# EasyEDA Pro project design.epro, schematic board_top_schematic

## Sheets
1 controller: Board Name: board_top; Create Date: 2025-03-20; Page Name: controller; Project Name: macropad-final; Schematic Name: board_top_schematic; Update Date: 2025-03-27; Company: EasyEDA.com; Page Size: A4; Version: V1.0
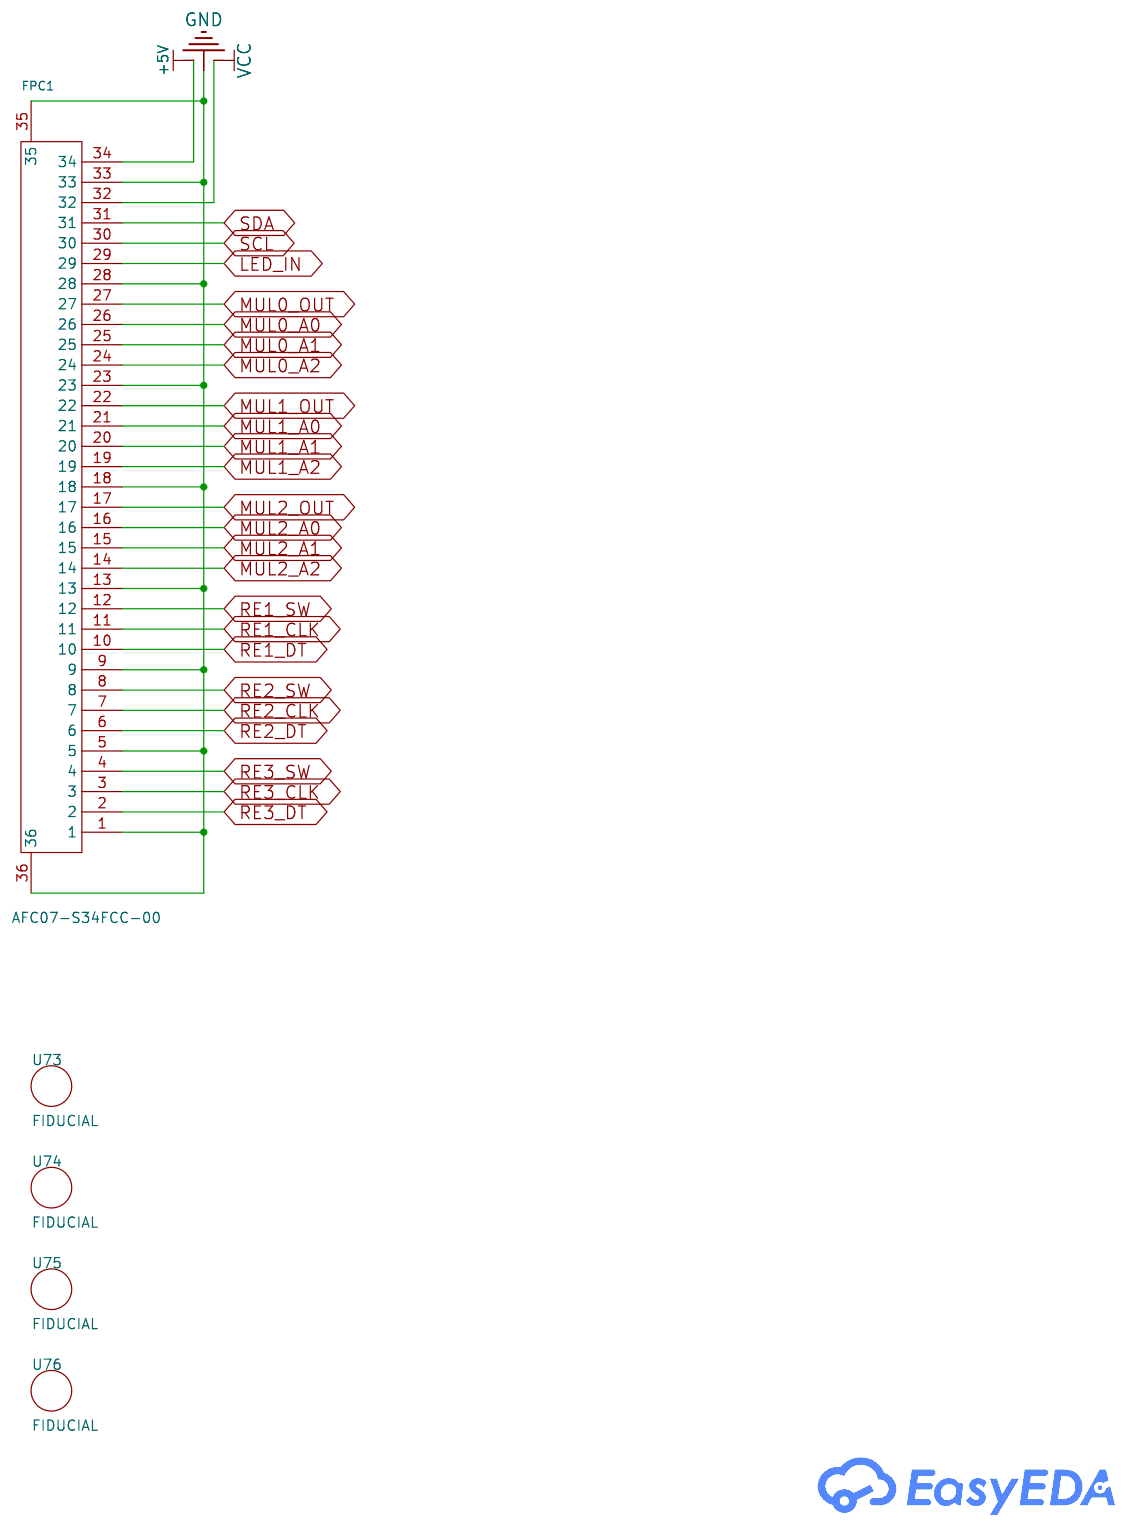
[diagram p4: controller]
2 button_matrix: Create Date: 2025-03-21; Page Name: button_matrix; Update Date: 2025-03-24
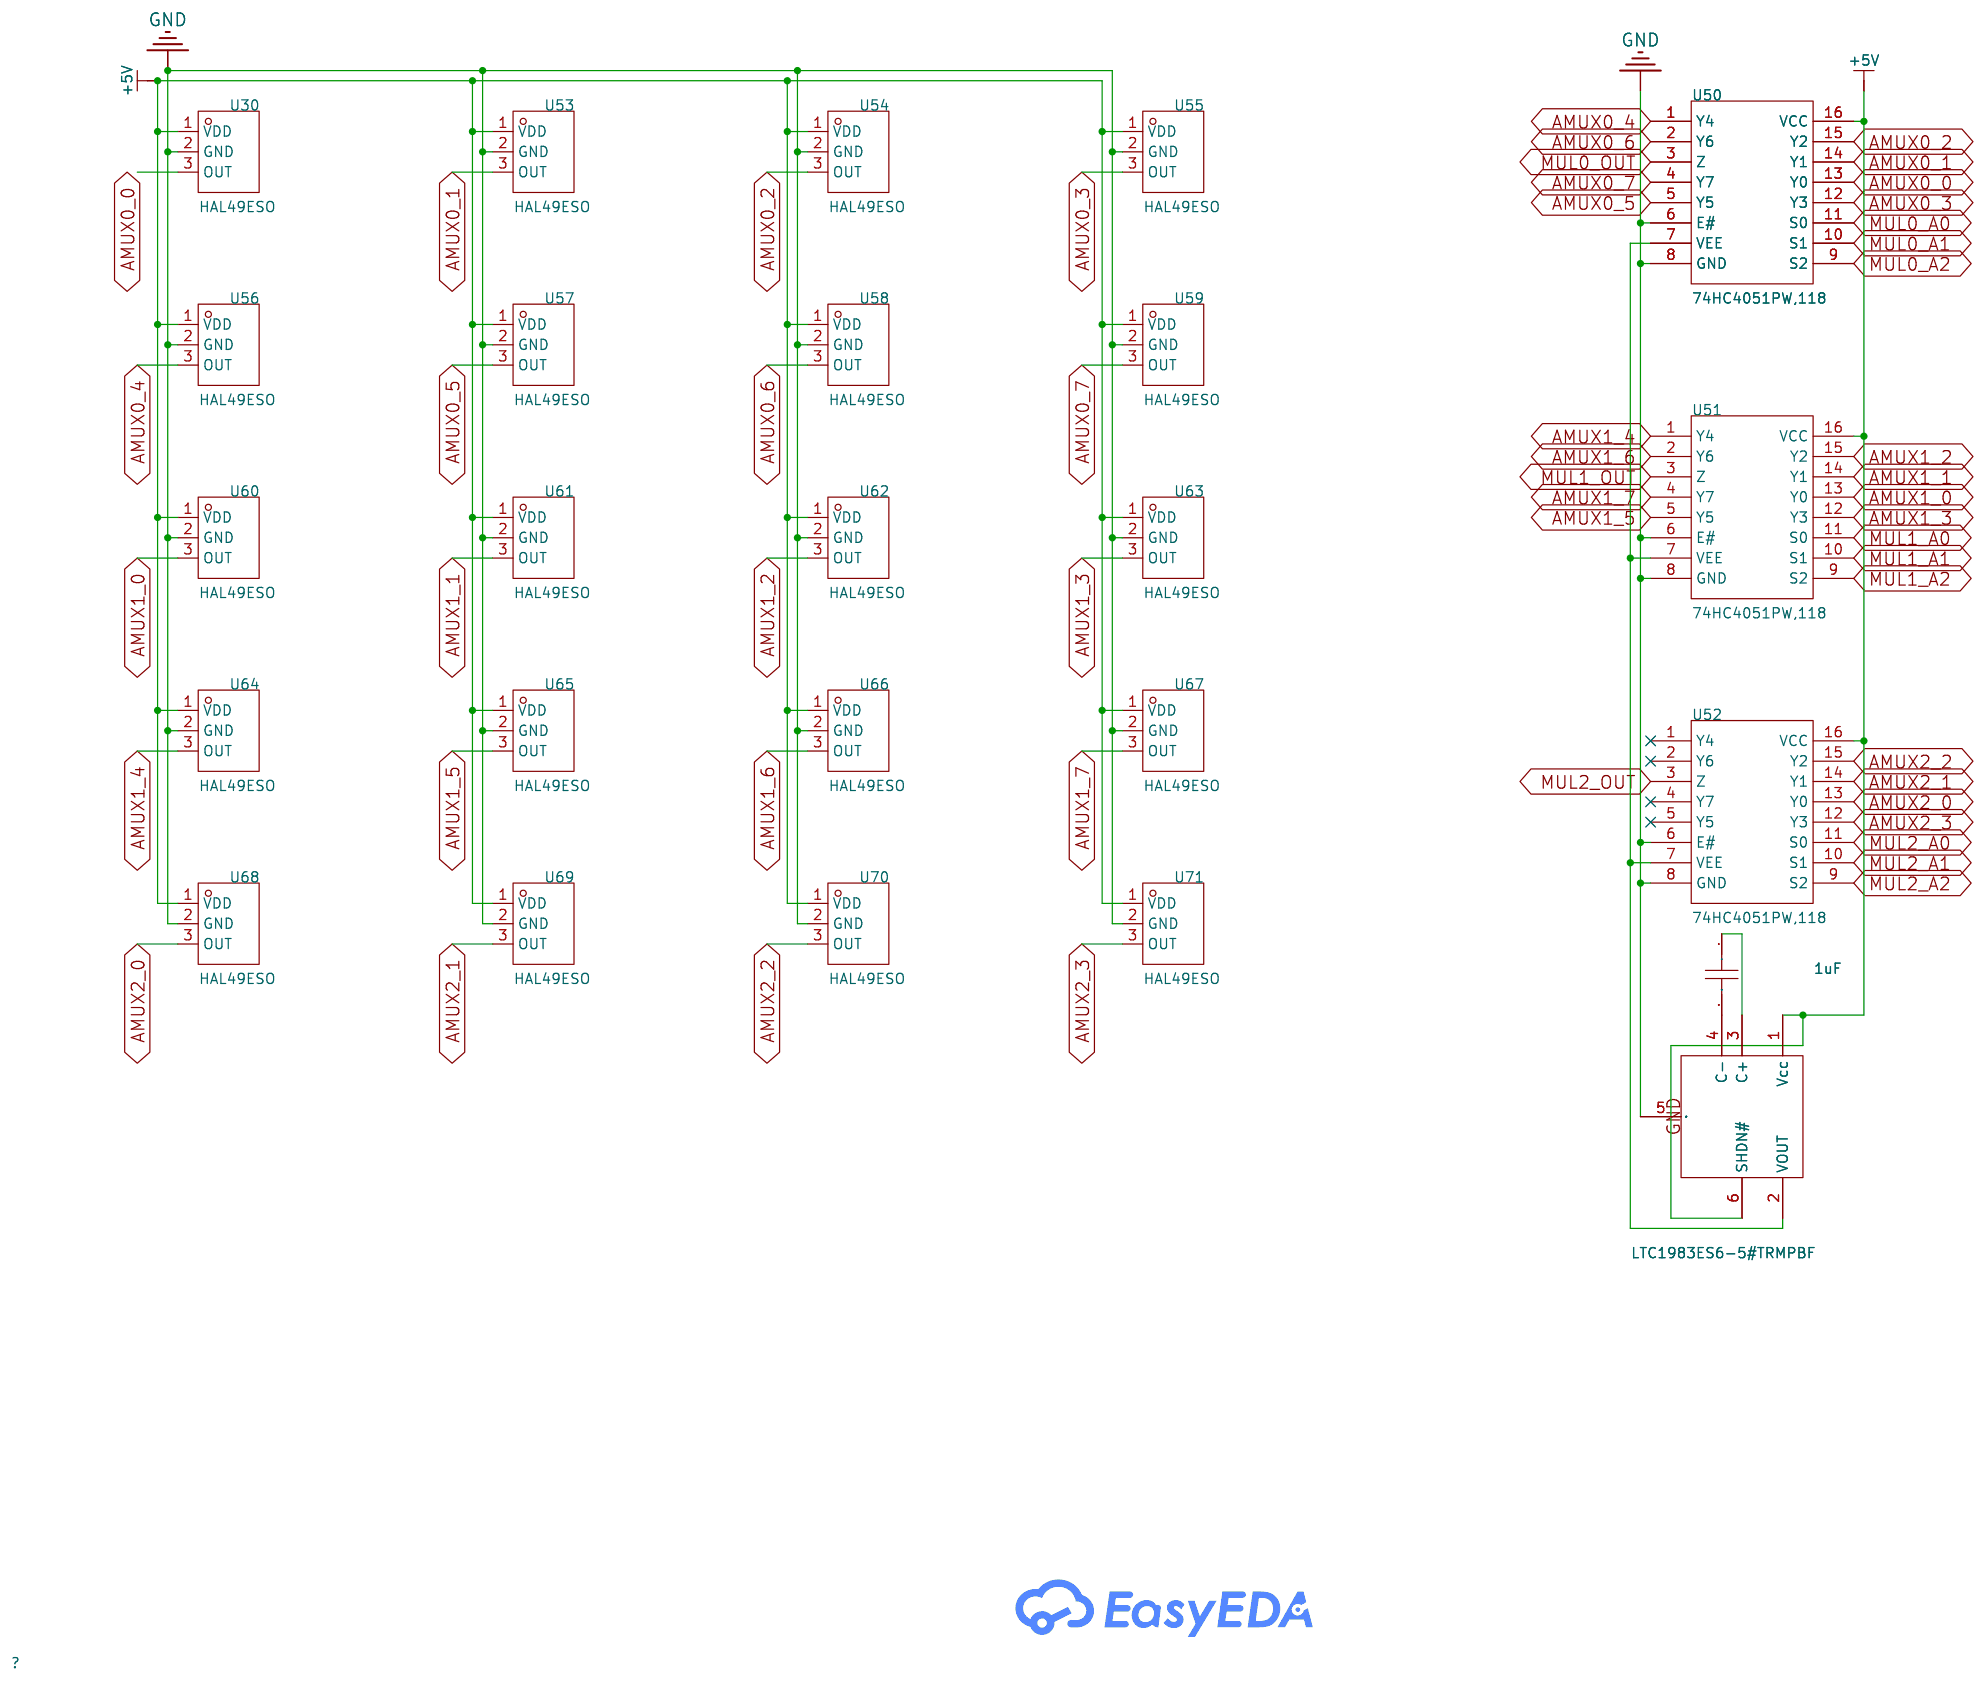
[diagram p5: button_matrix]
3 rotary_encoders: Create Date: 2025-03-21; Page Name: rotary_encoders; Update Date: 2025-03-23
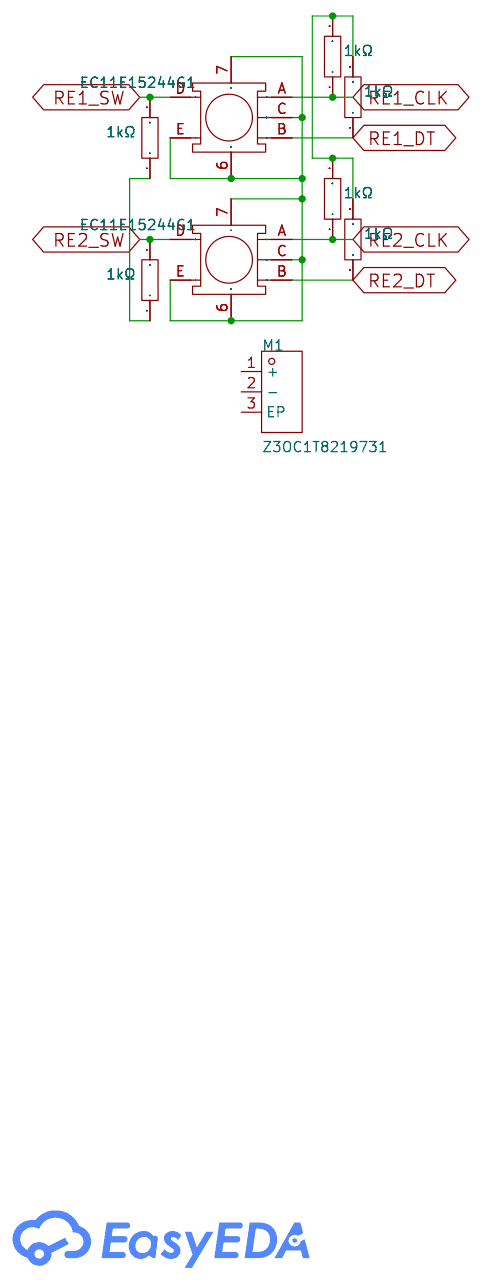
[diagram p6: rotary_encoders]
4 neopixels: Create Date: 2025-03-21; Page Name: neopixels; Update Date: 2025-03-26
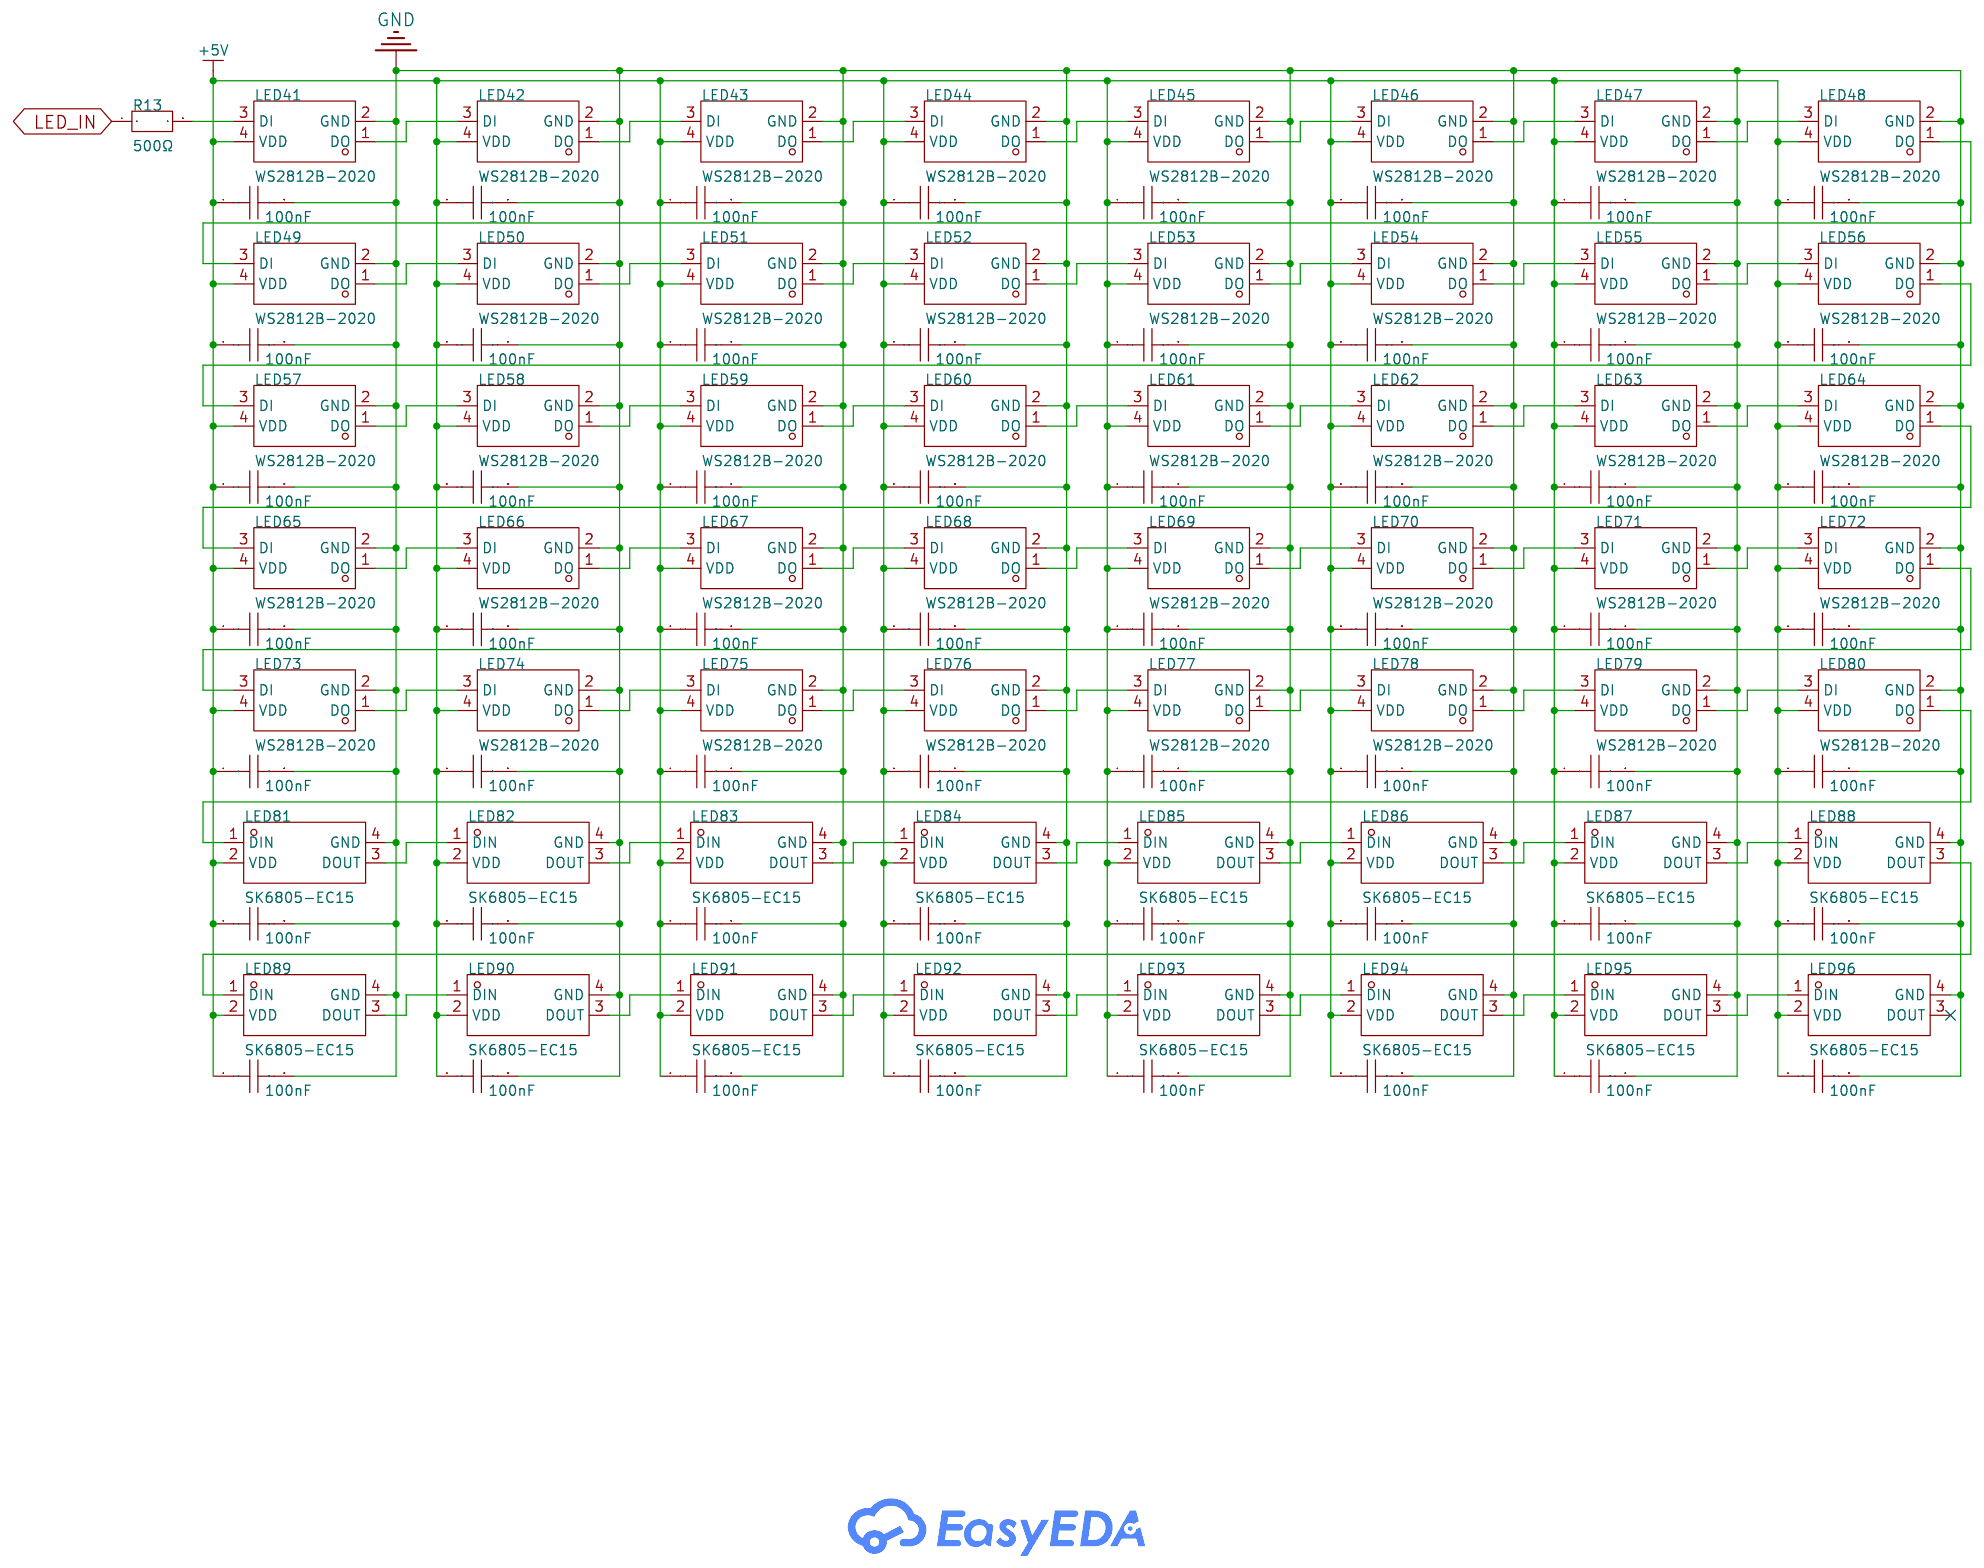
[diagram p7: neopixels]
5 lcd: Create Date: 2025-03-21; Page Name: lcd; Update Date: 2025-03-26
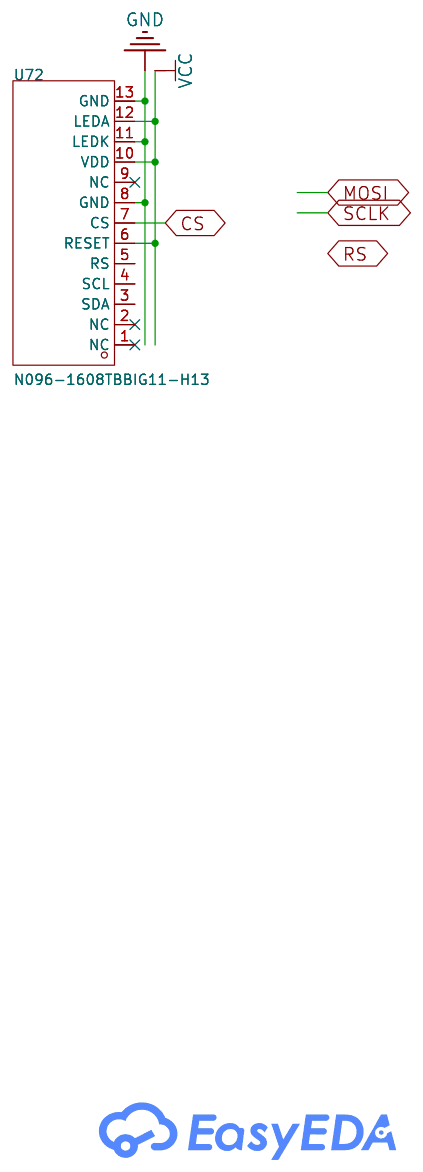
[diagram p8: lcd]

## Parts
sheet button_matrix
C1  1uF  [C0402]
U28  LTC1983ES6-5#TRMPBF  [SOT-23-6_L2.9-W1.6-P0.95-LS2.8-BR]
U30  HAL49ESO  [SOT-23-3_L2.9-W1.6-P1.90-LS2.8-BR-CW]
U50  74HC4051PW,118  [TSSOP-16_L5.0-W4.4-P0.65-LS6.4-BL]
U51  74HC4051PW,118  [TSSOP-16_L5.0-W4.4-P0.65-LS6.4-BL]
U52  74HC4051PW,118  [TSSOP-16_L5.0-W4.4-P0.65-LS6.4-BL]
U53  HAL49ESO  [SOT-23-3_L2.9-W1.6-P1.90-LS2.8-BR-CW]
U54  HAL49ESO  [SOT-23-3_L2.9-W1.6-P1.90-LS2.8-BR-CW]
U55  HAL49ESO  [SOT-23-3_L2.9-W1.6-P1.90-LS2.8-BR-CW]
U56  HAL49ESO  [SOT-23-3_L2.9-W1.6-P1.90-LS2.8-BR-CW]
U57  HAL49ESO  [SOT-23-3_L2.9-W1.6-P1.90-LS2.8-BR-CW]
U58  HAL49ESO  [SOT-23-3_L2.9-W1.6-P1.90-LS2.8-BR-CW]
U59  HAL49ESO  [SOT-23-3_L2.9-W1.6-P1.90-LS2.8-BR-CW]
U60  HAL49ESO  [SOT-23-3_L2.9-W1.6-P1.90-LS2.8-BR-CW]
U61  HAL49ESO  [SOT-23-3_L2.9-W1.6-P1.90-LS2.8-BR-CW]
U62  HAL49ESO  [SOT-23-3_L2.9-W1.6-P1.90-LS2.8-BR-CW]
U63  HAL49ESO  [SOT-23-3_L2.9-W1.6-P1.90-LS2.8-BR-CW]
U64  HAL49ESO  [SOT-23-3_L2.9-W1.6-P1.90-LS2.8-BR-CW]
U65  HAL49ESO  [SOT-23-3_L2.9-W1.6-P1.90-LS2.8-BR-CW]
U66  HAL49ESO  [SOT-23-3_L2.9-W1.6-P1.90-LS2.8-BR-CW]
U67  HAL49ESO  [SOT-23-3_L2.9-W1.6-P1.90-LS2.8-BR-CW]
U68  HAL49ESO  [SOT-23-3_L2.9-W1.6-P1.90-LS2.8-BR-CW]
U69  HAL49ESO  [SOT-23-3_L2.9-W1.6-P1.90-LS2.8-BR-CW]
U70  HAL49ESO  [SOT-23-3_L2.9-W1.6-P1.90-LS2.8-BR-CW]
U71  HAL49ESO  [SOT-23-3_L2.9-W1.6-P1.90-LS2.8-BR-CW]
sheet controller
FPC1  AFC07-S34FCC-00  [FPC-SMD_P0.50-34P_LCSXJ-H2.0]
U73  FIDUCIAL  [FIDUCIAL_1MM]
U74  FIDUCIAL  [FIDUCIAL_1MM]
U75  FIDUCIAL  [FIDUCIAL_1MM]
U76  FIDUCIAL  [FIDUCIAL_1MM]
sheet lcd
U72  N096-1608TBBIG11-H13  [OLED-SMD_ST7735S]
sheet neopixels
C2  100nF  [C0603]
C3  100nF  [C0603]
C4  100nF  [C0603]
C5  100nF  [C0603]
C6  100nF  [C0603]
C7  100nF  [C0603]
C8  100nF  [C0603]
C9  100nF  [C0603]
C10  100nF  [C0603]
C11  100nF  [C0603]
C12  100nF  [C0603]
C13  100nF  [C0603]
C14  100nF  [C0603]
C15  100nF  [C0603]
C16  100nF  [C0603]
C17  100nF  [C0603]
C18  100nF  [C0603]
C19  100nF  [C0603]
C20  100nF  [C0603]
C21  100nF  [C0603]
C22  100nF  [C0603]
C23  100nF  [C0603]
C24  100nF  [C0603]
C25  100nF  [C0603]
C26  100nF  [C0603]
C27  100nF  [C0603]
C28  100nF  [C0603]
C29  100nF  [C0603]
C30  100nF  [C0603]
C31  100nF  [C0603]
C32  100nF  [C0603]
C33  100nF  [C0603]
C34  100nF  [C0603]
C35  100nF  [C0603]
C36  100nF  [C0603]
C37  100nF  [C0603]
C38  100nF  [C0603]
C39  100nF  [C0603]
C40  100nF  [C0603]
C41  100nF  [C0603]
C42  100nF  [C0603]
C43  100nF  [C0603]
C44  100nF  [C0603]
C45  100nF  [C0603]
C46  100nF  [C0603]
C47  100nF  [C0603]
C48  100nF  [C0603]
C49  100nF  [C0603]
C50  100nF  [C0603]
C51  100nF  [C0603]
C52  100nF  [C0603]
C53  100nF  [C0603]
C54  100nF  [C0603]
C55  100nF  [C0603]
C56  100nF  [C0603]
C57  100nF  [C0603]
LED41  WS2812B-2020  [LED-SMD_4P-L2.0-W2.0-TL_WS2812B-2020]
LED42  WS2812B-2020  [LED-SMD_4P-L2.0-W2.0-TL_WS2812B-2020]
LED43  WS2812B-2020  [LED-SMD_4P-L2.0-W2.0-TL_WS2812B-2020]
LED44  WS2812B-2020  [LED-SMD_4P-L2.0-W2.0-TL_WS2812B-2020]
LED45  WS2812B-2020  [LED-SMD_4P-L2.0-W2.0-TL_WS2812B-2020]
LED46  WS2812B-2020  [LED-SMD_4P-L2.0-W2.0-TL_WS2812B-2020]
LED47  WS2812B-2020  [LED-SMD_4P-L2.0-W2.0-TL_WS2812B-2020]
LED48  WS2812B-2020  [LED-SMD_4P-L2.0-W2.0-TL_WS2812B-2020]
LED49  WS2812B-2020  [LED-SMD_4P-L2.0-W2.0-TL_WS2812B-2020]
LED50  WS2812B-2020  [LED-SMD_4P-L2.0-W2.0-TL_WS2812B-2020]
LED51  WS2812B-2020  [LED-SMD_4P-L2.0-W2.0-TL_WS2812B-2020]
LED52  WS2812B-2020  [LED-SMD_4P-L2.0-W2.0-TL_WS2812B-2020]
LED53  WS2812B-2020  [LED-SMD_4P-L2.0-W2.0-TL_WS2812B-2020]
LED54  WS2812B-2020  [LED-SMD_4P-L2.0-W2.0-TL_WS2812B-2020]
LED55  WS2812B-2020  [LED-SMD_4P-L2.0-W2.0-TL_WS2812B-2020]
LED56  WS2812B-2020  [LED-SMD_4P-L2.0-W2.0-TL_WS2812B-2020]
LED57  WS2812B-2020  [LED-SMD_4P-L2.0-W2.0-TL_WS2812B-2020]
LED58  WS2812B-2020  [LED-SMD_4P-L2.0-W2.0-TL_WS2812B-2020]
LED59  WS2812B-2020  [LED-SMD_4P-L2.0-W2.0-TL_WS2812B-2020]
LED60  WS2812B-2020  [LED-SMD_4P-L2.0-W2.0-TL_WS2812B-2020]
LED61  WS2812B-2020  [LED-SMD_4P-L2.0-W2.0-TL_WS2812B-2020]
LED62  WS2812B-2020  [LED-SMD_4P-L2.0-W2.0-TL_WS2812B-2020]
LED63  WS2812B-2020  [LED-SMD_4P-L2.0-W2.0-TL_WS2812B-2020]
LED64  WS2812B-2020  [LED-SMD_4P-L2.0-W2.0-TL_WS2812B-2020]
LED65  WS2812B-2020  [LED-SMD_4P-L2.0-W2.0-TL_WS2812B-2020]
LED66  WS2812B-2020  [LED-SMD_4P-L2.0-W2.0-TL_WS2812B-2020]
LED67  WS2812B-2020  [LED-SMD_4P-L2.0-W2.0-TL_WS2812B-2020]
LED68  WS2812B-2020  [LED-SMD_4P-L2.0-W2.0-TL_WS2812B-2020]
LED69  WS2812B-2020  [LED-SMD_4P-L2.0-W2.0-TL_WS2812B-2020]
LED70  WS2812B-2020  [LED-SMD_4P-L2.0-W2.0-TL_WS2812B-2020]
LED71  WS2812B-2020  [LED-SMD_4P-L2.0-W2.0-TL_WS2812B-2020]
LED72  WS2812B-2020  [LED-SMD_4P-L2.0-W2.0-TL_WS2812B-2020]
LED73  WS2812B-2020  [LED-SMD_4P-L2.0-W2.0-TL_WS2812B-2020]
LED74  WS2812B-2020  [LED-SMD_4P-L2.0-W2.0-TL_WS2812B-2020]
LED75  WS2812B-2020  [LED-SMD_4P-L2.0-W2.0-TL_WS2812B-2020]
LED76  WS2812B-2020  [LED-SMD_4P-L2.0-W2.0-TL_WS2812B-2020]
LED77  WS2812B-2020  [LED-SMD_4P-L2.0-W2.0-TL_WS2812B-2020]
LED78  WS2812B-2020  [LED-SMD_4P-L2.0-W2.0-TL_WS2812B-2020]
LED79  WS2812B-2020  [LED-SMD_4P-L2.0-W2.0-TL_WS2812B-2020]
LED80  WS2812B-2020  [LED-SMD_4P-L2.0-W2.0-TL_WS2812B-2020]
LED81  SK6805-EC15  [LED-SMD_4P-L1.5-W1.5-BL]
LED82  SK6805-EC15  [LED-SMD_4P-L1.5-W1.5-BL]
LED83  SK6805-EC15  [LED-SMD_4P-L1.5-W1.5-BL]
LED84  SK6805-EC15  [LED-SMD_4P-L1.5-W1.5-BL]
LED85  SK6805-EC15  [LED-SMD_4P-L1.5-W1.5-BL]
LED86  SK6805-EC15  [LED-SMD_4P-L1.5-W1.5-BL]
LED87  SK6805-EC15  [LED-SMD_4P-L1.5-W1.5-BL]
LED88  SK6805-EC15  [LED-SMD_4P-L1.5-W1.5-BL]
LED89  SK6805-EC15  [LED-SMD_4P-L1.5-W1.5-BL]
LED90  SK6805-EC15  [LED-SMD_4P-L1.5-W1.5-BL]
LED91  SK6805-EC15  [LED-SMD_4P-L1.5-W1.5-BL]
LED92  SK6805-EC15  [LED-SMD_4P-L1.5-W1.5-BL]
LED93  SK6805-EC15  [LED-SMD_4P-L1.5-W1.5-BL]
LED94  SK6805-EC15  [LED-SMD_4P-L1.5-W1.5-BL]
LED95  SK6805-EC15  [LED-SMD_4P-L1.5-W1.5-BL]
LED96  SK6805-EC15  [LED-SMD_4P-L1.5-W1.5-BL]
R13  500Ω  [R0805]
sheet rotary_encoders
M1  Z3OC1T8219731  [VIBRATING-MOTOR-SMD_3P-C9900001680]
R6  1kΩ  [R0603]
R7  1kΩ  [R0603]
R8  1kΩ  [R0603]
R9  1kΩ  [R0603]
R11  1kΩ  [R0603]
R12  1kΩ  [R0603]
SW1  EC11E15244G1  [SW-TH_EC11E15244G1]
SW2  EC11E15244G1  [SW-TH_EC11E15244G1]

## Library data of the parts
C1 = CL05A105KA5NQNC: Capacitance: Tolerance:±10% Tolerance:±10% Voltage Rated: Temperature Coefficient:; LCSC Part Name: 1uF ±10% 25V; Supplier Part: C52923; Manufacturer: SAMSUNG(三星); Supplier Footprint: 0402; JLCPCB Part Class: Basic Part; Datasheet: https://atta.szlcsc.com/upload/public/pdf/source/20160218/1457707763339.pdf; Supplier: LCSC; Tolerance: ±10%
U28 = LTC1983ES6-5#TRMPBF: Function:Step-down type Output Type:Fixed Input Voltage:2.3V~5.5V Input Voltage:2.3V~5.5V Output Voltage:-5V Output Voltage:-5V Output Current:100mA Switching Frequency:900kHz Switching Frequency:900kHz Operating Temperature:-40℃~+85℃@(TA) Operating Tempe; Supplier Part: C117346; Manufacturer: ADI(亚德诺); Supplier Footprint: TSOT-23-6; JLCPCB Part Class: Extended Part; Datasheet: https://atta.szlcsc.com/upload/public/pdf/source/20170712/C117346_1499832393379814529.pdf; Supplier: LCSC; Function: Step-down type; Output Type: Fixed; Input Voltage: 2.3V~5.5V; Output Voltage: -5V; Output Current: 100mA; Switching Frequency: 900kHz; Operating Temperature: -40℃~+85℃@(TA); Synchronous Rectification: No; Number of Outputs: 1; Topology: Inverted; Switch tube (built-in/external): Built-in
U30 U53-U71 = HAL49ESO: supply voltage:3V~6.5V supply voltage:3V~6.5V Operation Points:1000Gs Operation Points:1000Gs Operating Temperature:-40℃~+85℃ Operating Temperature:-40℃~+85℃; LCSC Part Name: 线性霍尔IC 调速线性霍尔传感器芯片; Supplier Part: C7420984; Manufacturer: Hallwee(霍尔微电子); Supplier Footprint: SOT-23-3L; JLCPCB Part Class: Extended Part; Datasheet: https://atta.szlcsc.com/upload/public/pdf/source/20230614/E37C3BA9DE7F08B9E0EC1099739D9073.pdf; Supplier: LCSC; supply voltage: 3V~6.5V; Operation Points: 1000Gs; Operating Temperature: -40℃~+85℃
U50-U52 = 74HC4051PW,118: Switch Circuit:SP8T single pole eight throw Number of Channels:8 Supply Voltage:2V~10V Supply Voltage:2V~10V Turn-on time:345ns On-State Resistance (Max):225Ω Turn-off time:365ns Operating Temperature:-40℃~+125℃ Operating Temperature:-40℃~+125℃; LCSC Part Name: 8通道模拟多路复用器/解复用器; Supplier Part: C5645; Manufacturer: Nexperia(安世); Supplier Footprint: TSSOP-16; JLCPCB Part Class: Extended Part; Datasheet: https://atta.szlcsc.com/upload/public/pdf/source/20240724/55B145ED26B61CE203AD3BB6AD5921DA.pdf; Supplier: LCSC; Switch Circuit: SP8T single pole eight throw; Number of Channels: 8; Supply Voltage: 2V~10V; Turn-on time: 345ns; On-State Resistance (Max): 225Ω; Turn-off time: 365ns; Operating Temperature: -40℃~+125℃
FPC1 = AFC07-S34FCC-00: Locking Feature:抽屉式 Contact Type:Bottom Contact Number of Contacts:34P Pitch:0.5mm Mounting Type:卧贴 FFC, FCB Thickness:0.3mm FFC, FCB Thickness:0.3mm Height Above Board:2mm; LCSC Part Name: 间距:0.5mm P数:34P 抽屉式 下接; Supplier Part: C262221; Manufacturer: JS(钜硕电子); Supplier Footprint: SMD,P=0.5mm,卧贴; JLCPCB Part Class: Extended Part; Datasheet: https://atta.szlcsc.com/upload/public/pdf/source/20190726/C11047_78689421E6D6672DE8D11ECCF89B3729.pdf; Supplier: LCSC; Locking Feature: 抽屉式; Contact Type: Bottom Contact; Number of Contacts: 34P; Pitch: 0.5mm; Mounting Type: 卧贴; FFC, FCB Thickness: 0.3mm; Height Above Board: 2mm
U73-U76 = FIDUCIAL
U72 = N096-1608TBBIG11-H13: Main Control Chip:ST7735S Size:0.96; LCSC Part Name: 0.96寸 13PIN TFT显示模块; Supplier Part: C2890616; Manufacturer: Newvision(新智景); JLCPCB Part Class: Extended Part; Datasheet: https://atta.szlcsc.com/upload/public/pdf/source/20231226/547EDAFF24C26DAA822C226E12BDC601.pdf; Supplier: LCSC; Main Control Chip: ST7735S; Size: 0.96
C2-C57 = CGA0603X7R104K500JT: Capacitance:100nF Tolerance:±10% Tolerance:±10% Voltage Rating:50V Temperature Coefficient:X7R; LCSC Part Name: 100nF ±10% 50V; Supplier Part: C6119867; Manufacturer: HRE(芯声); Supplier Footprint: 0603; JLCPCB Part Class: Extended Part; Datasheet: https://atta.szlcsc.com/upload/public/pdf/source/20250103/C44077DA9E7B3EFAE02F22B6D3D1CBC9.pdf; Supplier: LCSC; Tolerance: ±10%; Voltage Rating: 50V; Temperature Coefficient: X7R
LED41-LED80 = WS2812B-2020: Wavelength:515.6nm；622.5nm；470.4nm Luminous Intensity:- Fixed-Frequency Pwm Mode:- Data Transmission Rate:- Supply Voltage:- Supply Voltage:- Quiescent Dissipation:- Lens Color:-; LCSC Part Name: RGB三色; Supplier Part: C965555; Manufacturer: worldsemi; Supplier Footprint: SMD,2x2mm; JLCPCB Part Class: Extended Part; Datasheet: https://atta.szlcsc.com/upload/public/pdf/source/20241202/DEE3FC25B8AD87F3BB1718ACD77EDECD.pdf; Supplier: LCSC; Wavelength: 515.6nm；622.5nm；470.4nm
LED81-LED96 = SK6805-EC15: LCSC Part Name: RGB三色; Supplier Part: C2890035; Manufacturer: 欧思科光电; Supplier Footprint: 0606; JLCPCB Part Class: Extended Part; Datasheet: https://atta.szlcsc.com/upload/public/pdf/source/20210825/EBA988D9EF3F04A47033350D5CF2A1E1.pdf; Supplier: LCSC
R13 = ARG05FTC5000: Type:Thin Film Resistor Resistance: Tolerance:±1% Tolerance:±1% Power(Watts): Overload Voltage (Max): Temperature Coefficient:±25ppm/℃ Temperature Coefficient:±25ppm/℃ Operating Temperature Range:-55℃~+155℃ Operating Temperature Range:-55℃~+155℃; LCSC Part Name: 薄膜电阻 500Ω ±1% 125mW; Supplier Part: C2828857; Manufacturer: Viking(光颉); Supplier Footprint: 0805; JLCPCB Part Class: Extended Part; Datasheet: https://atta.szlcsc.com/upload/public/pdf/source/20210426/C2828737_35D2DDB0BDDA00747C2712435E28BBD4.pdf; Supplier: LCSC; Type: Thin Film Resistor; Tolerance: ±1%; Temperature Coefficient: ±25ppm/℃; Operating Temperature Range: -55℃~+155℃
M1 = Z3OC1T8219731: Type:Cylindrical DC Motor Voltage Rating:2.7V Voltage Rating:2.7V Current Rating:85mA Rated Speed:14000±2500rpm Operating Temperature:-20℃~+70℃ Operating Temperature:-20℃~+70℃ Sense Of Rotation:CW; Supplier Part: C2894731; Manufacturer: KOTL(金龙机电); JLCPCB Part Class: Extended Part; Datasheet: https://atta.szlcsc.com/upload/public/pdf/source/20210908/21604D4C77F5141C93AFC2CF1DCB74B9.pdf; Supplier: LCSC; Type: Cylindrical DC Motor; Voltage Rating: 2.7V; Current Rating: 85mA; Rated Speed: 14000±2500rpm; Operating Temperature: -20℃~+70℃; Sense Of Rotation: CW
R6-R9 R11 R12 = RC0603FR-071KL: Type:Thick Film Resistors Resistance: Tolerance:±1% Tolerance:±1% Power(Watts): Overload Voltage (Max): Temperature Coefficient:±100ppm/℃ Temperature Coefficient:±100ppm/℃ Operating Temperature Range:-55℃~+155℃ Operating Temperature Range:-55℃~+155℃; LCSC Part Name: 厚膜电阻 1kΩ ±1% 100mW; Supplier Part: C22548; Manufacturer: YAGEO(国巨); Supplier Footprint: 0603; JLCPCB Part Class: Extended Part; Datasheet: https://atta.szlcsc.com/upload/public/pdf/source/20180316/70C0E2BDAE7FCC62C531A5A58D202EE1.pdf; Supplier: LCSC; Type: Thick Film Resistors; Tolerance: ±1%; Temperature Coefficient: ±100ppm/℃; Operating Temperature Range: -55℃~+155℃; Check: true
SW1 SW2 = EC11E15244G1: LCSC Part Name: 编码器; Supplier Part: C370970; Manufacturer: ALPSALPINE(阿尔卑斯阿尔派); Supplier Footprint: 插件; JLCPCB Part Class: Extended Part; Datasheet: https://atta.szlcsc.com/upload/public/pdf/source/20190222/C370970_45D3DFC793E5CF6FACAF06DB9E7FAE9E.pdf; Supplier: LCSC

## Nets
+5V: C2.1 C3.1 C4.1 C5.1 C6.1 C7.1 C8.1 C9.1 C10.1 C11.1 C12.1 C13.1 C14.1 C15.1 C16.1 C17.1 C18.1 C19.1 C20.1 C21.1 C22.1 C23.1 C24.1 C25.1 C26.1 C27.1 C28.1 C29.1 C30.1 C31.1 C32.1 C33.1 C34.1 C35.1 C36.1 C37.1 C38.1 C39.1 C40.1 C41.1 C42.1 C43.1 C44.1 C45.1 C46.1 C47.1 C48.1 C49.1 C50.1 C51.1 C52.1 C53.1 C54.1 C55.1 C56.1 C57.1 FPC1.34 LED41.4(VDD) LED42.4(VDD) LED43.4(VDD) LED44.4(VDD) LED45.4(VDD) LED46.4(VDD) LED47.4(VDD) LED48.4(VDD) LED49.4(VDD) LED50.4(VDD) LED51.4(VDD) LED52.4(VDD) LED53.4(VDD) LED54.4(VDD) LED55.4(VDD) LED56.4(VDD) LED57.4(VDD) LED58.4(VDD) LED59.4(VDD) LED60.4(VDD) LED61.4(VDD) LED62.4(VDD) LED63.4(VDD) LED64.4(VDD) LED65.4(VDD) LED66.4(VDD) LED67.4(VDD) LED68.4(VDD) LED69.4(VDD) LED70.4(VDD) LED71.4(VDD) LED72.4(VDD) LED73.4(VDD) LED74.4(VDD) LED75.4(VDD) LED76.4(VDD) LED77.4(VDD) LED78.4(VDD) LED79.4(VDD) LED80.4(VDD) LED81.2(VDD) LED82.2(VDD) LED83.2(VDD) LED84.2(VDD) LED85.2(VDD) LED86.2(VDD) LED87.2(VDD) LED88.2(VDD) LED89.2(VDD) LED90.2(VDD) LED91.2(VDD) LED92.2(VDD) LED93.2(VDD) LED94.2(VDD) LED95.2(VDD) LED96.2(VDD) U28.1(Vcc) U28.6(SHDN#) U30.1(VDD) U50.16(VCC) U51.16(VCC) U52.16(VCC) U53.1(VDD) U54.1(VDD) U55.1(VDD) U56.1(VDD) U57.1(VDD) U58.1(VDD) U59.1(VDD) U60.1(VDD) U61.1(VDD) U62.1(VDD) U63.1(VDD) U64.1(VDD) U65.1(VDD) U66.1(VDD) U67.1(VDD) U68.1(VDD) U69.1(VDD) U70.1(VDD) U71.1(VDD)
GND: C2.2 C3.2 C4.2 C5.2 C6.2 C7.2 C8.2 C9.2 C10.2 C11.2 C12.2 C13.2 C14.2 C15.2 C16.2 C17.2 C18.2 C19.2 C20.2 C21.2 C22.2 C23.2 C24.2 C25.2 C26.2 C27.2 C28.2 C29.2 C30.2 C31.2 C32.2 C33.2 C34.2 C35.2 C36.2 C37.2 C38.2 C39.2 C40.2 C41.2 C42.2 C43.2 C44.2 C45.2 C46.2 C47.2 C48.2 C49.2 C50.2 C51.2 C52.2 C53.2 C54.2 C55.2 C56.2 C57.2 FPC1.1 FPC1.5 FPC1.9 FPC1.13 FPC1.18 FPC1.23 FPC1.28 FPC1.33 FPC1.35 FPC1.36 LED41.2(GND) LED42.2(GND) LED43.2(GND) LED44.2(GND) LED45.2(GND) LED46.2(GND) LED47.2(GND) LED48.2(GND) LED49.2(GND) LED50.2(GND) LED51.2(GND) LED52.2(GND) LED53.2(GND) LED54.2(GND) LED55.2(GND) LED56.2(GND) LED57.2(GND) LED58.2(GND) LED59.2(GND) LED60.2(GND) LED61.2(GND) LED62.2(GND) LED63.2(GND) LED64.2(GND) LED65.2(GND) LED66.2(GND) LED67.2(GND) LED68.2(GND) LED69.2(GND) LED70.2(GND) LED71.2(GND) LED72.2(GND) LED73.2(GND) LED74.2(GND) LED75.2(GND) LED76.2(GND) LED77.2(GND) LED78.2(GND) LED79.2(GND) LED80.2(GND) LED81.4(GND) LED82.4(GND) LED83.4(GND) LED84.4(GND) LED85.4(GND) LED86.4(GND) LED87.4(GND) LED88.4(GND) LED89.4(GND) LED90.4(GND) LED91.4(GND) LED92.4(GND) LED93.4(GND) LED94.4(GND) LED95.4(GND) LED96.4(GND) SW1.6 SW1.7 SW1.C SW1.E SW2.6 SW2.7 SW2.C SW2.E U28.5(GND) U30.2(GND) U50.6(E#) U50.8(GND) U51.6(E#) U51.8(GND) U52.6(E#) U52.8(GND) U53.2(GND) U54.2(GND) U55.2(GND) U56.2(GND) U57.2(GND) U58.2(GND) U59.2(GND) U60.2(GND) U61.2(GND) U62.2(GND) U63.2(GND) U64.2(GND) U65.2(GND) U66.2(GND) U67.2(GND) U68.2(GND) U69.2(GND) U70.2(GND) U71.2(GND) U72.8(GND) U72.11(LEDK) U72.13(GND)
VCC: FPC1.32 U72.6(RESET) U72.10(VDD) U72.12(LEDA)
AMUX0_0: U50.13(Y0)
AMUX0_1: U50.14(Y1) U53.3(OUT)
AMUX0_2: U50.15(Y2) U54.3(OUT)
AMUX0_3: U50.12(Y3) U55.3(OUT)
AMUX0_4: U50.1(Y4) U56.3(OUT)
AMUX0_5: U50.5(Y5) U57.3(OUT)
AMUX0_6: U50.2(Y6) U58.3(OUT)
AMUX0_7: U50.4(Y7) U59.3(OUT)
AMUX1_0: U51.13(Y0) U60.3(OUT)
AMUX1_1: U51.14(Y1) U61.3(OUT)
AMUX1_2: U51.15(Y2) U62.3(OUT)
AMUX1_3: U51.12(Y3) U63.3(OUT)
AMUX1_4: U51.1(Y4) U64.3(OUT)
AMUX1_5: U51.5(Y5) U65.3(OUT)
AMUX1_6: U51.2(Y6) U66.3(OUT)
AMUX1_7: U51.4(Y7) U67.3(OUT)
AMUX2_0: U52.13(Y0) U68.3(OUT)
AMUX2_1: U52.14(Y1) U69.3(OUT)
AMUX2_2: U52.15(Y2) U70.3(OUT)
AMUX2_3: U52.12(Y3) U71.3(OUT)
CS: U72.7(CS)
LED_IN: FPC1.29 R13.1
MUL0_A0: FPC1.26 U50.11(S0)
MUL0_A1: FPC1.25 U50.10(S1)
MUL0_A2: FPC1.24 U50.9(S2)
MUL0_OUT: FPC1.27 U50.3(Z)
MUL1_A0: FPC1.21 U51.11(S0)
MUL1_A1: FPC1.20 U51.10(S1)
MUL1_A2: FPC1.19 U51.9(S2)
MUL1_OUT: FPC1.22 U51.3(Z)
MUL2_A0: FPC1.16 U52.11(S0)
MUL2_A1: FPC1.15 U52.10(S1)
MUL2_A2: FPC1.14 U52.9(S2)
MUL2_OUT: FPC1.17 U52.3(Z)
RE1_CLK: FPC1.11 R7.1 SW1.A
RE1_DT: FPC1.10 R8.1 SW1.B
RE1_SW: FPC1.12 R12.2 SW1.D
RE2_CLK: FPC1.7 R6.1 SW2.A
RE2_DT: FPC1.6 R9.1 SW2.B
RE2_SW: FPC1.8 R11.2 SW2.D
RE3_CLK: FPC1.3
RE3_DT: FPC1.2
RE3_SW: FPC1.4
SCL: FPC1.30
SDA: FPC1.31
$2N18265: C1.1 U28.3(C+)
$2N18293: U28.2(VOUT) U50.7(VEE) U51.7(VEE) U52.7(VEE)
$2N18448: C1.2 U28.4(C-)
$3N3094: R6.2 R7.2 R8.2 R9.2
$3N3099: R11.1 R12.1
$4N29908: LED41.3(DI) R13.2
$4N34136: LED41.1(DO) LED42.3(DI)
$4N34954: LED42.1(DO) LED43.3(DI)
$4N35046: LED43.1(DO) LED44.3(DI)
$4N35138: LED44.1(DO) LED45.3(DI)
$4N35230: LED45.1(DO) LED46.3(DI)
$4N35322: LED46.1(DO) LED47.3(DI)
$4N35414: LED47.1(DO) LED48.3(DI)
$4N35506: LED48.1(DO) LED49.3(DI)
$4N35598: LED49.1(DO) LED50.3(DI)
$4N35690: LED50.1(DO) LED51.3(DI)
$4N35782: LED51.1(DO) LED52.3(DI)
$4N35874: LED52.1(DO) LED53.3(DI)
$4N35966: LED53.1(DO) LED54.3(DI)
$4N36058: LED54.1(DO) LED55.3(DI)
$4N36150: LED55.1(DO) LED56.3(DI)
$4N36242: LED56.1(DO) LED57.3(DI)
$4N36334: LED57.1(DO) LED58.3(DI)
$4N36426: LED58.1(DO) LED59.3(DI)
$4N36518: LED59.1(DO) LED60.3(DI)
$4N36610: LED60.1(DO) LED61.3(DI)
$4N36702: LED61.1(DO) LED62.3(DI)
$4N36794: LED62.1(DO) LED63.3(DI)
$4N36886: LED63.1(DO) LED64.3(DI)
$4N36978: LED64.1(DO) LED65.3(DI)
$4N37070: LED65.1(DO) LED66.3(DI)
$4N37162: LED66.1(DO) LED67.3(DI)
$4N37254: LED67.1(DO) LED68.3(DI)
$4N37346: LED68.1(DO) LED69.3(DI)
$4N37438: LED69.1(DO) LED70.3(DI)
$4N37530: LED70.1(DO) LED71.3(DI)
$4N37622: LED71.1(DO) LED72.3(DI)
$4N39085: LED77.1(DO) LED78.3(DI)
$4N39089: LED79.1(DO) LED80.3(DI)
$4N39093: LED76.1(DO) LED77.3(DI)
$4N39097: LED78.1(DO) LED79.3(DI)
$4N39101: LED74.1(DO) LED75.3(DI)
$4N39105: LED75.1(DO) LED76.3(DI)
$4N39109: LED73.1(DO) LED74.3(DI)
$4N39113: LED72.1(DO) LED73.3(DI)
$4N64211: LED81.3(DOUT) LED82.1(DIN)
$4N64236: LED80.1(DO) LED81.1(DIN)
$4N65487: LED82.3(DOUT) LED83.1(DIN)
$4N65864: LED83.3(DOUT) LED84.1(DIN)
$4N66245: LED84.3(DOUT) LED85.1(DIN)
$4N66630: LED85.3(DOUT) LED86.1(DIN)
$4N67019: LED86.3(DOUT) LED87.1(DIN)
$4N67412: LED87.3(DOUT) LED88.1(DIN)
$4N68362: LED94.3(DOUT) LED95.1(DIN)
$4N68391: LED95.3(DOUT) LED96.1(DIN)
$4N68395: LED93.3(DOUT) LED94.1(DIN)
$4N68399: LED92.3(DOUT) LED93.1(DIN)
$4N68403: LED89.3(DOUT) LED90.1(DIN)
$4N68407: LED91.3(DOUT) LED92.1(DIN)
$4N68411: LED90.3(DOUT) LED91.1(DIN)
$4N68415: LED88.3(DOUT) LED89.1(DIN)

Not connected (* = marked no-connect by the designer): LED96 3(DOUT)*; M1 1(+) 2(-) 3(EP); U30 3(OUT); U52 1(Y4)* 2(Y6)* 4(Y7)* 5(Y5)*; U72 1(NC)* 2(NC)* 3(SDA) 4(SCL) 5(RS) 9(NC)*
